# EAGLE schematic MINI_SAM_D51_001 (EAGLE 9.0.0)
BUILD: 2018/01; DESIGNER: BENJAMIN SHOCKLEY; REV: A
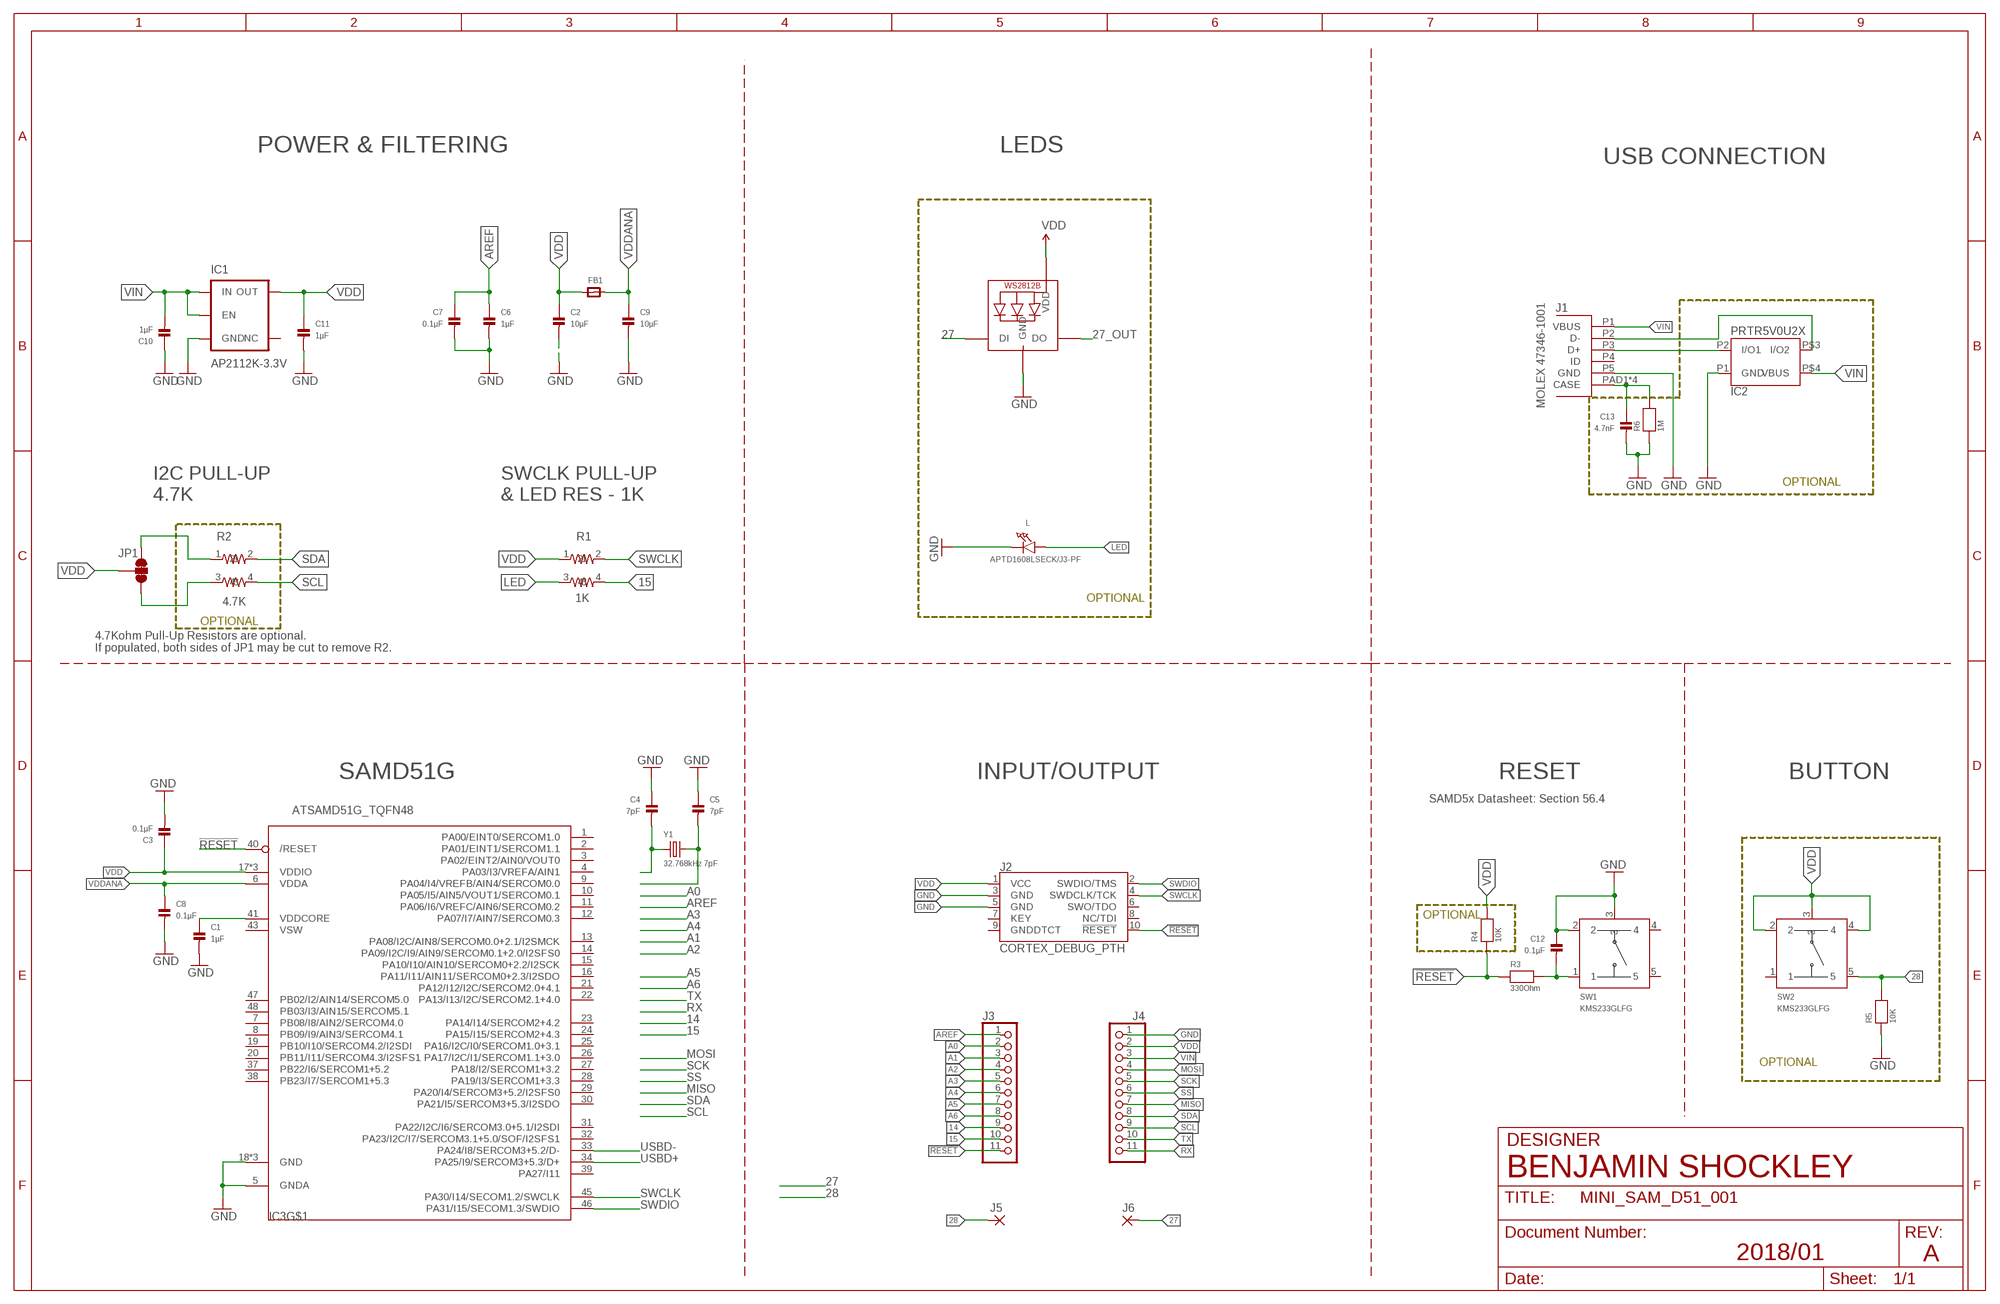
[diagram p0: schematic, sheet 1]

## Parts
C1  1µF  CAP_CERAMIC_0805MP  [_0805MP]
C2  10µF  CAP_CERAMIC_0805MP  [_0805MP]
C3  0.1µF  CAP_CERAMIC_0805MP  [_0805MP]
C4  7pF  CAP_CERAMIC_0805MP  [_0805MP]
C5  7pF  CAP_CERAMIC_0805MP  [_0805MP]
C6  1µF  CAP_CERAMIC_0805MP  [_0805MP]
C7  0.1µF  CAP_CERAMIC_0805MP  [_0805MP]
C8  0.1µF  CAP_CERAMIC_0805MP  [_0805MP]
C9  10µF  CAP_CERAMIC_0805MP  [_0805MP]
C10  1µF  CAP_CERAMIC_0805MP  [_0805MP]
C11  1µF  CAP_CERAMIC_0805MP  [_0805MP]
C12  0.1µF  CAP_CERAMIC_0805MP  [_0805MP]
C13  4.7nF  CAP_CERAMIC_0805MP  [_0805MP]
FB1  FERRITE_0805MP  [_0805MP]
IC1  AP2112K-3.3V  V_REG_AP2112K-3.3V  [SOT23-5]
IC2  PRTR5V0U2X  [SOT143B_REFLOW]
IC3  ATSAMD51G_TQFN48  [TQFN48_7MM]
J1  MOLEX_47346-100147346  [MOLEX_47346-1001]
J2  CORTEX_DEBUG_PTH  [2X5-PTH-1.27MM]
J3  PINHD-1X111X11_SMT  [1X11_SMT]
J4  PINHD-1X111X11_SMT  [1X11_SMT]
J5  FR11_PAD2MMX1MM  [SMD2MMX1MM]
J6  FR11_PAD2MMX1MM  [SMD2MMX1MM]
JP1  JUMPER-SMT_3_2-NC_TRACE_NO-SILK  [SMT-JUMPER_3_2-NC_TRACE_NO-SILK]
L  APTD1608LSECK/J3-PF  LED0603_NOOUTLINE  [CHIPLED_0603_NOOUTLINE]
R1  1K  RESISTOR_ARRAY_2  [RESISTOR_ARRAY_0606]
R2  4.7K  RESISTOR_ARRAY_2  [RESISTOR_ARRAY_0606]
R3  330Ohm  RESISTOR_0805MP  [_0805MP]
R4  10K  RESISTOR_0805MP  [_0805MP]
R5  10K  RESISTOR_0805MP  [_0805MP]
R6  1M  RESISTOR_0805MP  [_0805MP]
RGB  WS2812B3535  [LED3535]
SW1  KMS233GLFG  KMS_SWITCHKMS  [KMS_SWITCH]
SW2  KMS233GLFG  KMS_SWITCHKMS  [KMS_SWITCH]
Y1  32.768kHz 7pF  CRYSTAL0805PACKAGE  [_0805MP]

## Nets
14: J3.9
15: J3.10 R1.4
27: J6.P$1(P) RGB.1(DI)
27_OUT: RGB.3(DO)
28: J5.P$1(P) R5.2 SW2.5
!RESET: IC3.40(/RESET) J2.10(!RESET) J3.11 R3.1 R4.1
A0: J3.2
A1: J3.3
A2: J3.4
A3: J3.5
A4: J3.6
A5: J3.7
A6: J3.8
AREF: C6.1 C7.1 J3.1
GND: C1.2 C2.2 C3.2 C4.1 C5.1 C6.2 C7.2 C8.2 C9.2 C10.1 C11.2 C12.1 C13.2 IC1.2(GND) IC2.P1(GND) IC3.5(GNDA) IC3.18(GND) IC3.35(GND) IC3.42(GND) J1.P5(GND) J2.3(GND) J2.5(GND) J4.1 L.C R5.1 R6.1 RGB.4(GND) SW1.2 SW1.3
LED: L.A R1.3
MISO: J4.7
MOSI: J4.4
N$1: C4.2 Y1.1
N$2: C13.1 J1.PAD1(CASE) J1.PAD2(CASE) J1.PAD3(CASE) J1.PAD4(CASE) R6.2
N$3: JP1.1 R2.1
N$4: C12.2 R3.2 SW1.1
N$5: C5.2 Y1.2
N$6: JP1.3 R2.3
N$9: C1.1 IC3.41(VDDCORE)
RX: J4.11
SCK: J4.5
SCL: J4.9 R2.4
SDA: J4.8 R2.2
SS: J4.6
SWCLK: IC3.45(PA30/I14/SECOM1.2/SWCLK) J2.4(SWDCLK/TCK) R1.2
SWDIO: IC3.46(PA31/I15/SECOM1.3/SWDIO) J2.2(SWDIO/TMS)
TX: J4.10
USBD+ [USB_DATA]: IC2.P2(I/O1) IC3.34(PA25/I9/SERCOM3+5.3/D+) J1.P3(D+)
USBD- [USB_DATA]: IC2.P$3(I/O2) IC3.33(PA24/I8/SERCOM3+5.2/D-) J1.P2(D-)
VDD: C2.1 C3.1 C11.1 FB1.1 IC1.5(OUT) IC3.17(VDDIO) IC3.36(VDDIO) IC3.44(VDDIO) J2.1(VCC) J4.2 JP1.2 R1.1 R4.2 RGB.2(VDD) SW2.2 SW2.3 SW2.4
VDDANA: C8.1 C9.1 FB1.2 IC3.6(VDDA)
VIN: C10.2 IC1.1(IN) IC1.3(EN) IC2.P$4(VBUS) J1.P1(VBUS) J4.3
Unconnected: IC1.4(NC) IC3.1(PA00/EINT0/SERCOM1.0) IC3.2(PA01/EINT1/SERCOM1.1) IC3.3(PA02/EINT2/AIN0/VOUT0) IC3.4(PA03/I3/VREFA/AIN1) IC3.7(PB08/I8/AIN2/SERCOM4.0) IC3.8(PB09/I9/AIN3/SERCOM4.1) IC3.9(PA04/I4/VREFB/AIN4/SERCOM0.0) IC3.10(PA05/I5/AIN5/VOUT1/SERCOM0.1) IC3.11(PA06/I6/VREFC/AIN6/SERCOM0.2) IC3.12(PA07/I7/AIN7/SERCOM0.3) IC3.13(PA08/I2C/AIN8/SERCOM0.0+2.1/I2SMCK) IC3.14(PA09/I2C/I9/AIN9/SERCOM0.1+2.0/I2SFS0) IC3.15(PA10/I10/AIN10/SERCOM0+2.2/I2SCK) IC3.16(PA11/I11/AIN11/SERCOM0+2.3/I2SDO) IC3.19(PB10/I10/SERCOM4.2/I2SDI) IC3.20(PB11/I11/SERCOM4.3/I2SFS1) IC3.21(PA12/I12/I2C/SERCOM2.0+4.1) IC3.22(PA13/I13/I2C/SERCOM2.1+4.0) IC3.23(PA14/I14/SERCOM2+4.2) IC3.24(PA15/I15/SERCOM2+4.3) IC3.25(PA16/I2C/I0/SERCOM1.0+3.1) IC3.26(PA17/I2C/I1/SERCOM1.1+3.0) IC3.27(PA18/I2/SERCOM1+3.2) IC3.28(PA19/I3/SERCOM1+3.3) IC3.29(PA20/I4/SERCOM3+5.2/I2SFS0) IC3.30(PA21/I5/SERCOM3+5.3/I2SDO) IC3.31(PA22/I2C/I6/SERCOM3.0+5.1/I2SDI) IC3.32(PA23/I2C/I7/SERCOM3.1+5.0/SOF/I2SFS1) IC3.37(PB22/I6/SERCOM1+5.2) IC3.38(PB23/I7/SERCOM1+5.3) IC3.39(PA27/I11) IC3.47(PB02/I2/AIN14/SERCOM5.0) IC3.48(PB03/I3/AIN15/SERCOM5.1) J1.P4(ID) J2.6(SWO/TDO) J2.7(KEY) J2.8(NC/TDI) J2.9(GNDDTCT) SW1.4 SW1.5 SW2.1

## Notes on the sheet
- POWER & FILTERING | LEDS
- USB CONNECTION
- MOLEX 47346-1001
- OPTIONAL
- I2C PULL-UP
  4.7K
- SWCLK PULL-UP
  & LED RES - 1K
- OPTIONAL
- OPTIONAL
- 4.7Kohm Pull-Up Resistors are optional.
  If populated, both sides of JP1 may be cut to remove R2.
- SAMD51G | INPUT/OUTPUT | RESET | BUTTON
- SAMD5x Datasheet: Section 56.4
- OPTIONAL
- OPTIONAL
- DESIGNER

## Power pins joined to a net without a drawn wire
TP: IC3.THERMAL(TP)
VSW: IC3.43(VSW)

## Library data of the parts
C1-C13 = microbuilder:CAP_CERAMIC: Ceramic Capacitors 0402 - 0402 Surface Mount Capacitors 16pF 50V 5% [Digikey: 445-4899-2-ND] 18pF 50V 5% [Digikey: 490-1281-2-ND] 22pF 50V 5% [Digikey: 490-1283-2-ND] 68pF 50V 5% [Digikey: 490-1289-2-ND] 0.1uF 10V 10% [Digikey: 490-1318-2-ND] 1.0uF 6.3V 10% [Digikey: 490-1320-2-ND] 0603 - 0603 Surface Mount Capacitors 16 pF 50V 5% [Digikey: 445-5051-2-ND] 22 pF 50V [Digikey: PCC220ACVTR-ND] 33 pF 50V 5% [Digikey: 490-1415-1-ND] 56pF 50V 5% [Digikey: 490-1421-1-ND] 220pF 50V 5% [Digikey: 445-1285-1-ND] 680 pF 50V 2200 pF 50V 5% C0G [Digikey: 445-1297-1-ND] 5600 pF 100V 5% X7R [Digikey: 478-3711-1-ND] 0.1 µF 25V 10% [Digikey: PCC2277TR-ND] 0.22 µF 16V 10% X7R [Digikey: 445-1318-1-ND] 1.0 µF 25V 10% [Digikey: 445-5146-2-ND] 0603 - RF Specific 3pF 250V +/-0.1pF RF [Digikey: 712-1347-1-ND] 18 pF 250V 5% [Digikey: 478-3505-1-ND or 712-1322-1-ND] 56 pF 250V 5% C0G RF [Digikey: 490-4867-1-ND] 68 pF 250V RF [Digikey: 490-4868-1-ND] 0805 - 0805 Surface Mount Capacitors 220 pF 250V 2% RF Ceramic Capacitor [Digikey: 712-1398-1-ND] 1000 pF 50V 2% NP0 Ceramic Capacitor [Digikey: 478-3760-1-ND] 0.1 µF 25V 10% Ceramic Capacitor [Digikey: PCC1828TR-ND] 1.0 µF 16V 10% Ceramic Capacitor[Digikey: 490-1691-2-ND] 10.0 µF 10V 10% Ceramic Capacitor[Digikey: 709-1228-1-ND] 10.0 uF 16V 10% Ceramic Capacitor [Digikey: 478-5165-2-ND] 47 uF 6.3V 20% Ceramic Capacitor [Digikey: 587-1779-1-ND or 399-5506-1-ND] 1206 - 1206 Surface Mount Capacitors 47uF 10V 20% Ceramic Capacitor [Digikey: 490-5528-1-ND or 399-5508-1-ND or 445-6010-1-ND] 100uF 6.3V -20%, +80% Y5V Ceramic Capacitor (Digikey: 490-4512-1-ND, Mouser: 81-GRM31CF50J107ZE1L)
FB1 = microbuilder:FERRITE: Ferrite Bead 0603 MMZ1608B121C - 120 Ohm @ 100MHz, 600mA, 0.15 Ohm DC Resistance - Digikey: 445-2164-1-ND BK1608HW121-T - 120 Ohm, 600mA Ferrite Chip - Digikey: 587-1876-2-ND 0805 HZ0805B272R-10 - 2.7K Ohm @ 100MHz, 200mA, 0.8 Ohm DC Resistance - Digikey: 240-2504-1-ND (see also Murata BLM21BD272SN1L) MMZ2012Y152B - 1.5K Ohm @ 100MHz, 500mA, 0.4 Ohm DC Resistance - Digikey: 445-1560-1-ND - Mainly for high frequency (80-400MHz) MMZ2012R102A - 1K Ohm @ 100MHz, 500mA, 0.3 Ohm DC Resistance - Digikey: 445-1555-2-ND - More general purpose (10-200MHz)
IC1 = SparkFun-PowerIC:V_REG_AP2112: AP2112 - 600mA CMOS LDO Regulator w/ Enable The AP2112 is CMOS process low dropout linear regulator with enable function, the regulator delivers a guaranteed 600mA (min.) continuous load current. Features Output Voltage Accuracy: ±1.5% Output Current: 600mA (Min.) Foldback Short Current Protection: 50mA Enable Function to Turn ON/OFF VOUT Low Dropout Voltage (3.3V): 250mV (Typ.) @IOUT=600mA Excellent Load Regulation: 0.2%/A (Typ.) Excellent Line Regulation: 0.02%/V (Typ.) Low Quiescent Current: 55μA (Typ.) Low Standby Current: 0.01μA (Typ.) Low Output Noise: 50μVRMS PSRR: 100Hz -65dB, 1kHz -65dB OTSD Protection Stable with 1.0μF Flexible Cap: Ceramic, Tantalum and Aluminum Electrolytic Operation Temperature Range: -40°C to 85°C ESD: MM 400V, HBM 4000V; PROD_ID: VREG-12457; VALUE: 3.3V
IC2 = Shockley_Custom:PRTR5V0U2X
IC3 = microbuilder:ATSAMD51G
J1 = Shockley_Custom:MOLEX_47346-1001
J2 = SparkFun-Connectors:CORTEX_DEBUG: Cortex Debug Connector - 10 pin Supports JTAG debug, Serial Wire debug, and Serial Wire Viewer. PTH and SMD connector options available. General Connector Information <http://infocenter.arm.com/help/topic/com.arm.doc.faqs/attached/13634/cortex_debug_connectors.pdf> Products: PTH Connector <http://www.digikey.com/product-detail/en/cnc-tech/3220-10-0100-00/1175-1627-ND/3883661> -via Digi-Key SparkFun PSoc <https://www.sparkfun.com/products/13229> SparkFun T <https://www.sparkfun.com/products/13810>
J3 J4 = pinhead+:PINHD-1X11: PIN HEADER
J5 J6 = Shockley_Custom:FR11_PAD
JP1 = SparkFun-Jumpers:JUMPER-SMT_3_2-NC_TRACE: Normally closed trace jumper (2 of 2 connections) This jumper has a trace between all three pads so they are normally closed (NC). Use a razor knife to open the connection(s). For best results follow the IPC guidelines for cutting traces: Cutout at least 0.063 mm (0.005 in). Remove all loose material to clean up the cut area. Seal the cut with an approved epoxy. Reapply solder to reclose the connection(s).
L = microbuilder:LED: LED 0603 - 0603 Surface Mount Package 2mA: Green LED - Low Power (3.9mcd, 2ma, 1.7Vf) - Digikey: 475-2709-2-ND Orange LED - Low Power (9.8mcd, 2ma, 1.8Vf) - Digikey: 475-1194-2-ND Red LED - Low Power (5mcd, 2ma, 1.8Vf) - Digikey: 475-1195-2-ND Yellow LED - Low Power (7mcd, 2ma, 1.8Vf) - Digikey: 475-1196-2-ND 5mA: Blue LED - Low Power (17mcd, 5ma, 2.9Vf) - Digikey: LNJ937W8CRACT-ND 0805 - 0805 Surface Mount Package 2mA: Red LED (8.8mcd, 2mA, 1.8Vf, Clear) - Low Power [Digikey: 475-2510-1-ND] Green LED (5mcd, 2mA, 1.8Vf, Clear) - Low Power [Digikey: 475-2730-1-ND] Yellow LED (11.3mcd, 2mA, 1.8Vf, Clear) - Low Power [Digikey: 475-2555-1-ND] 20mA: Red LED (104mcd, 20mA, Diffused) - LS R976 [Digikey: 475-1278-6-ND] Red LED (12mcd, 20mA, 2.0Vf, Clear) - APT2012EC [Digikey: 754-1128-1-ND] Green LED (15mcd, 20mA, 2.2Vf, Clear) - APT2012GC [Digikey: 754-1131-1-ND] Orange LED (160mcd, 20mA, 2.1Vf, Clear) - APT2012SECK [Digikey: 754-1130-1-ND] 1206 - 1206 Surface Mount Package Green LED (26mcd, 20mA, Diffused) - LG N971 [Digikey: 475-1407-6-ND] Red LED (15mcd, 20mA, Diffused) - LH N974 [Digikey: 475-1416-6-ND]
R1 R2 = Shockley_Custom:RESISTOR_ARRAY_2
R3-R6 = microbuilder:RESISTOR: Resistors 0402 - 0402 Surface Mount Package 22 Ohm 1% 1/16W [Digikey: 311-22.0LRTR-ND] 33 Ohm 5% 1/16W 1.0K 5% 1/16W 1.5K 5% 1/16W 2.0K 1% 1/16W 10.0K 1% 1/16W [Digikey: 311-10.0KLRTR-ND] 10.0K 5% 1/16W [Digikey: RMCF0402JT10K0TR-ND] 12.1K 1% 1/16W [Digikey: 311-22.0LRTR-ND] 100.0K 5% 1/16W 0603 - 0603 Surface Mount Package 0 Ohm 1/10 Watt 1% Resistor 15 Ohm 1/10 Watt 1% Resistor 33 Ohm 1/10 Watt 1% Resistor 49.9 Ohm 1/10 Watt 1% Resistor 100 Ohm 1/10 Watt 1% Resistor 150 Ohm 1/10 Watt 1% Resistor 240 Ohm 1/10 Watt 1% Resistor 390 Ohm 1/10 Watt 1% Resistor 560 Ohm 1/10 Watt 1% Resistor 680 Ohm 1/10 Watt 1% Resistor 750 Ohm 1/10 Watt 1% Resistor 1.0K Ohm 1/10 Watt 1% Resistor 1.5K Ohm 1/10 Watt 1% Resistor 2.0K Ohm 1/10 Watt 1% Resistor 2.2K Ohm 1/10 Watt 1% Resistor 3.3K Ohm 1/10 Watt 1% Resistor 4.7K Ohm 1/10 Watt 1% Resistor 10.0K Ohm 1/10 Watt 1% Resistor 12.0K Ohm 1/10 Watt 1% Resistor 12.1K Ohm 1/10 Watt 1% Resistor 20.0K Ohm 1/10 Watt 1% Resistor 33.0K Ohm 1/10 Watt 1% Resistor 100.0K Ohm 1/10 Watt 1% Resistor 0805 - 0805 Surface Mount Package 0 Ohm 1/8 Watt 1% Resistor 33 Ohm 1/8 Watt 1% Resistor 100 Ohm 1/8 Watt 1% Resistor 150 Ohm 1/8 Watt 1% Resistor 200 Ohm 1/8 Watt 1% Resistor 240 Ohm 1/8 Watt 1% Resistor 330 Ohm 1/8 Watt 1% Resistor 390 Ohm 1/8 Watt 1% Resistor 470 Ohm 1/8 Watt 1% Resistor 1.0K Ohm 1/8 Watt 1% Resistor 1.5K Ohm 1/8 Watt 1% Resistor 2.0K Ohm 1/8 Watt 1% Resistor 4.7K Ohm 1/8 Watt 1% Resistor 5.1K Ohm 1/8 Watt 1% Resistor 5.6K Ohm 1/8 Watt 1% Resistor 10.0K Ohm 1/8 Watt 1% Resistor 22.0K Ohm 1/8 Watt 1% Resistor 33.0K Ohm 1/8 Watt 1% Resistor 100K Ohm 1/8 Watt 1% Resistor 1206 - 1206 Surface Mount Package 2012 - 2010 Surface Mount Package 0.11 Ohm 1/2 Watt 1% Resistor - Digikey: RHM.11UCT-ND
RGB = adafruit:WS2812B
SW1 SW2 = Shockley_Custom:KMS_SWITCH
Y1 = Shockley_Custom:CRYSTAL: Crystals HC49UP - Surface Mount Crystal 4.0MHz 18pF +/-30ppm Surface Mount Crystal [Digikey: 535-9857-1-ND] 12.0 MHz Surface Mount Crystal [Digikey: 535-9869-6-ND] 25.0 MHz Surface Mount Crystal [Digikey: 535-9078-1-ND] 2.5 x 2.0mm - MEMs SMT Crystal 16.0 MHz 10pF 20ppm 2.5 x 2.0mm Crystal [Digikey -40-85°C: 535-10923-1-ND] 3.2 x 2.5mm - MEMs SMT Crystal 12.0 MHz 8pF 15ppm 3.2 x 2.5mm Crystal [Digikey: -10-70°C: 644-1047-1-ND -40-125°C: 644-1128-1-ND] 16.0 MHz 8pF 15ppm 3.2 x 2.5mm Crystal [Digikey: -10-70°C: 644-1049-1-ND -40-125°C: 644-1129-2-ND] 16.0 MHz 10pF 10ppm 3.2 x 2.5mm Crystal [Digikey: 644-1100-1-ND] 27.12 MHz 18pF 30ppm 3.2 x 2.5mm Crystal [Digikey: 887-1424-1-ND] 27.12MHz 10pF 10ppm 3.2 x 2.5mm Crystal [Digikey: 887-1329-1-ND] 4.9 x 1.8mm - MEMs SMT Crystal 32.768 KHz 12.5pF 20ppm 4.9 x 1.8mm Crystal [Digikey: SE2415CT-ND] 8.0 x 3.8mm - Surface Mount Crystal 32.768kHz 12.5pF 20ppm -40°C-85°C [Digikey: 535-9166-2-ND] Cylinder 32.768KHz Cylinder Crystal (2x6mm body) [Ex. Digikey: 300-8341-2-ND]